# Altium project PCB_Project1.PrjPCB
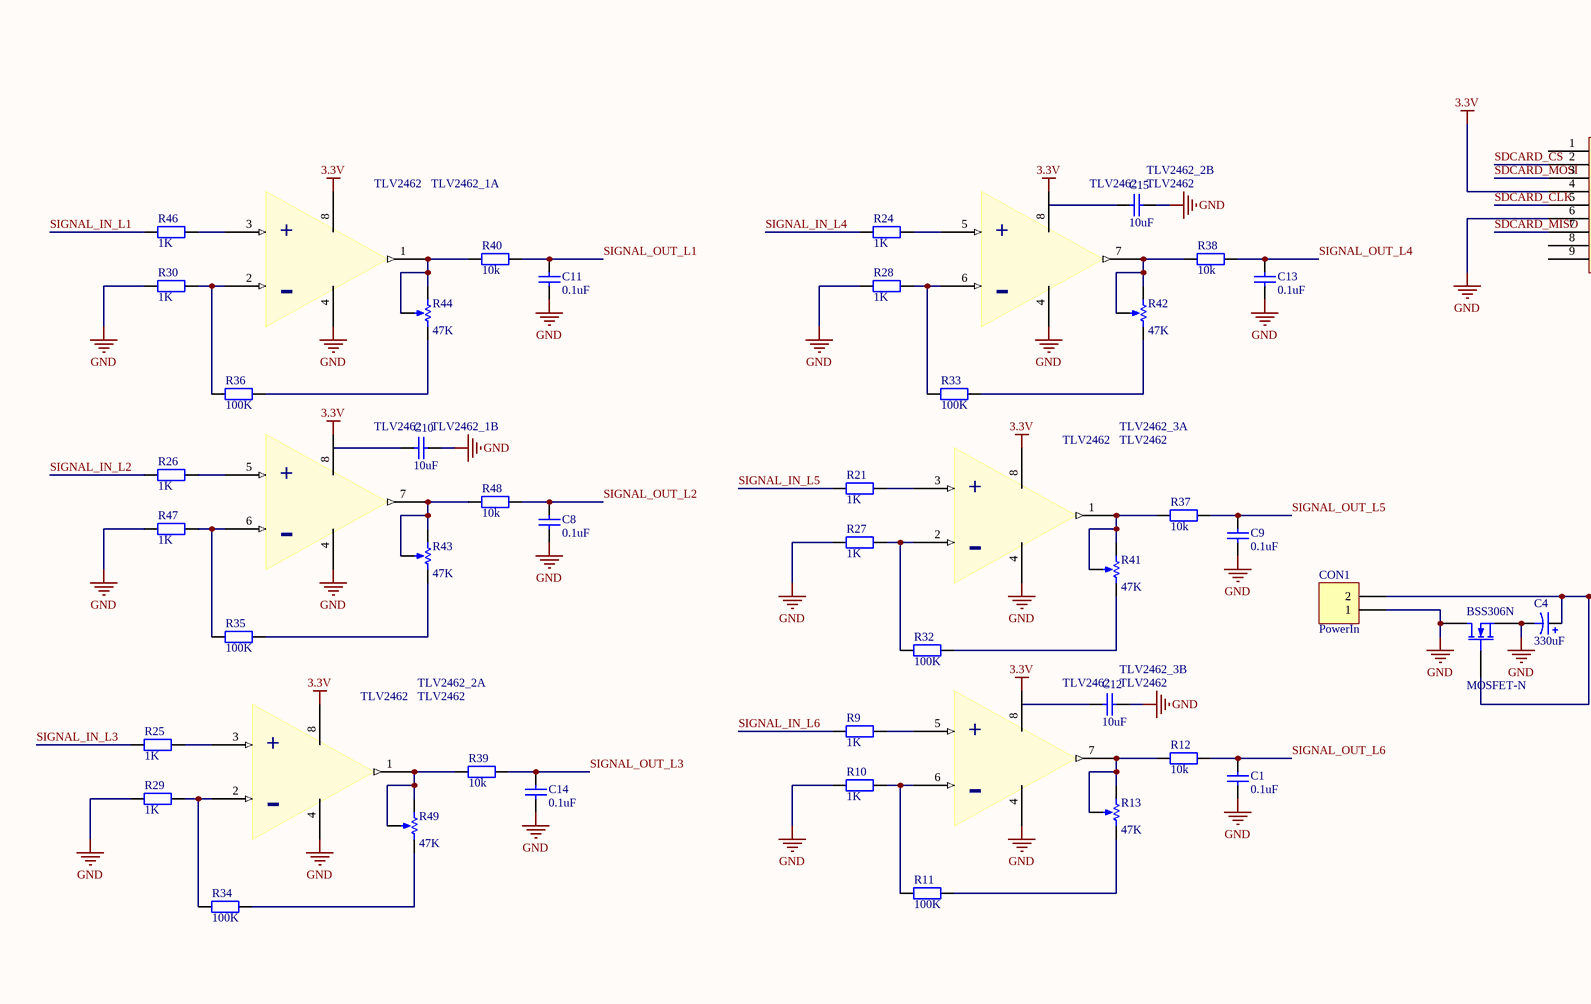
[diagram p0: control.SchDoc, top left]
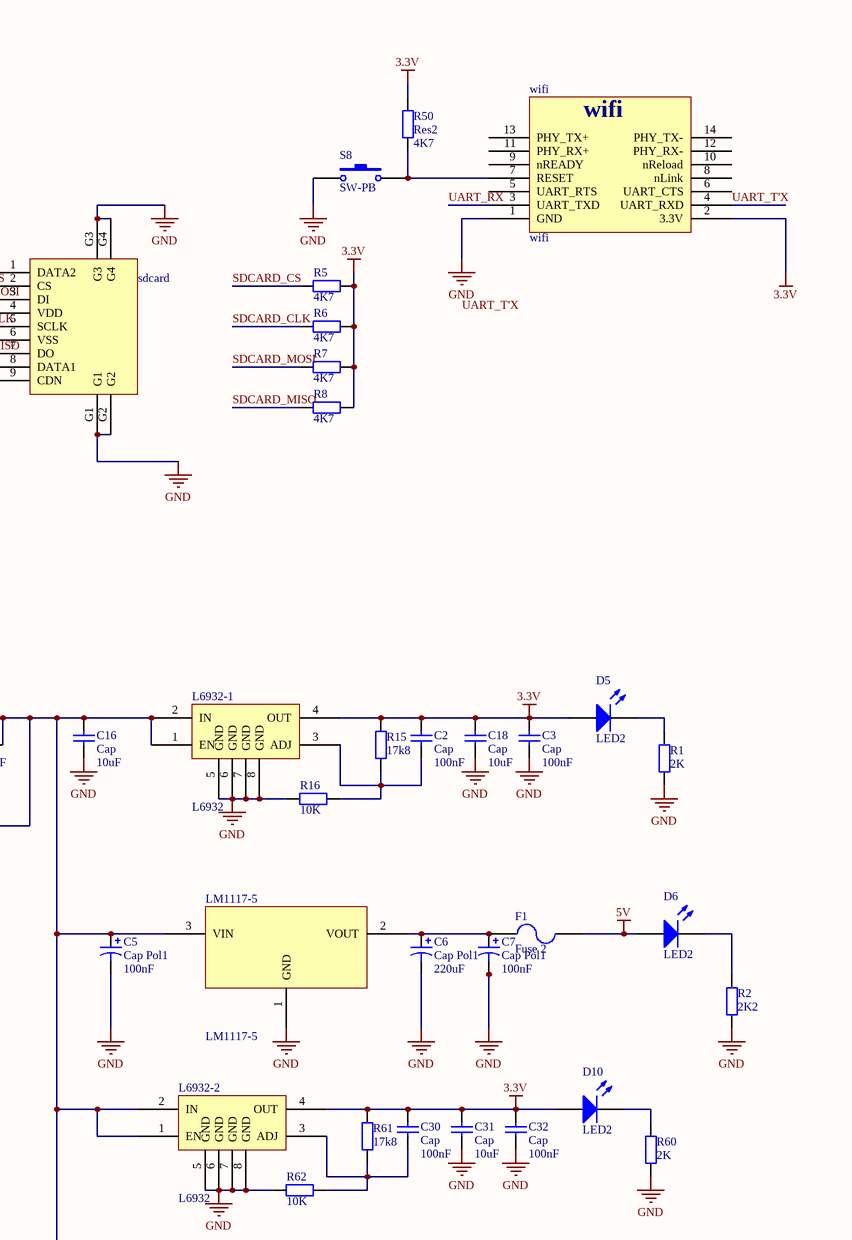
[diagram p1: control.SchDoc, top right]
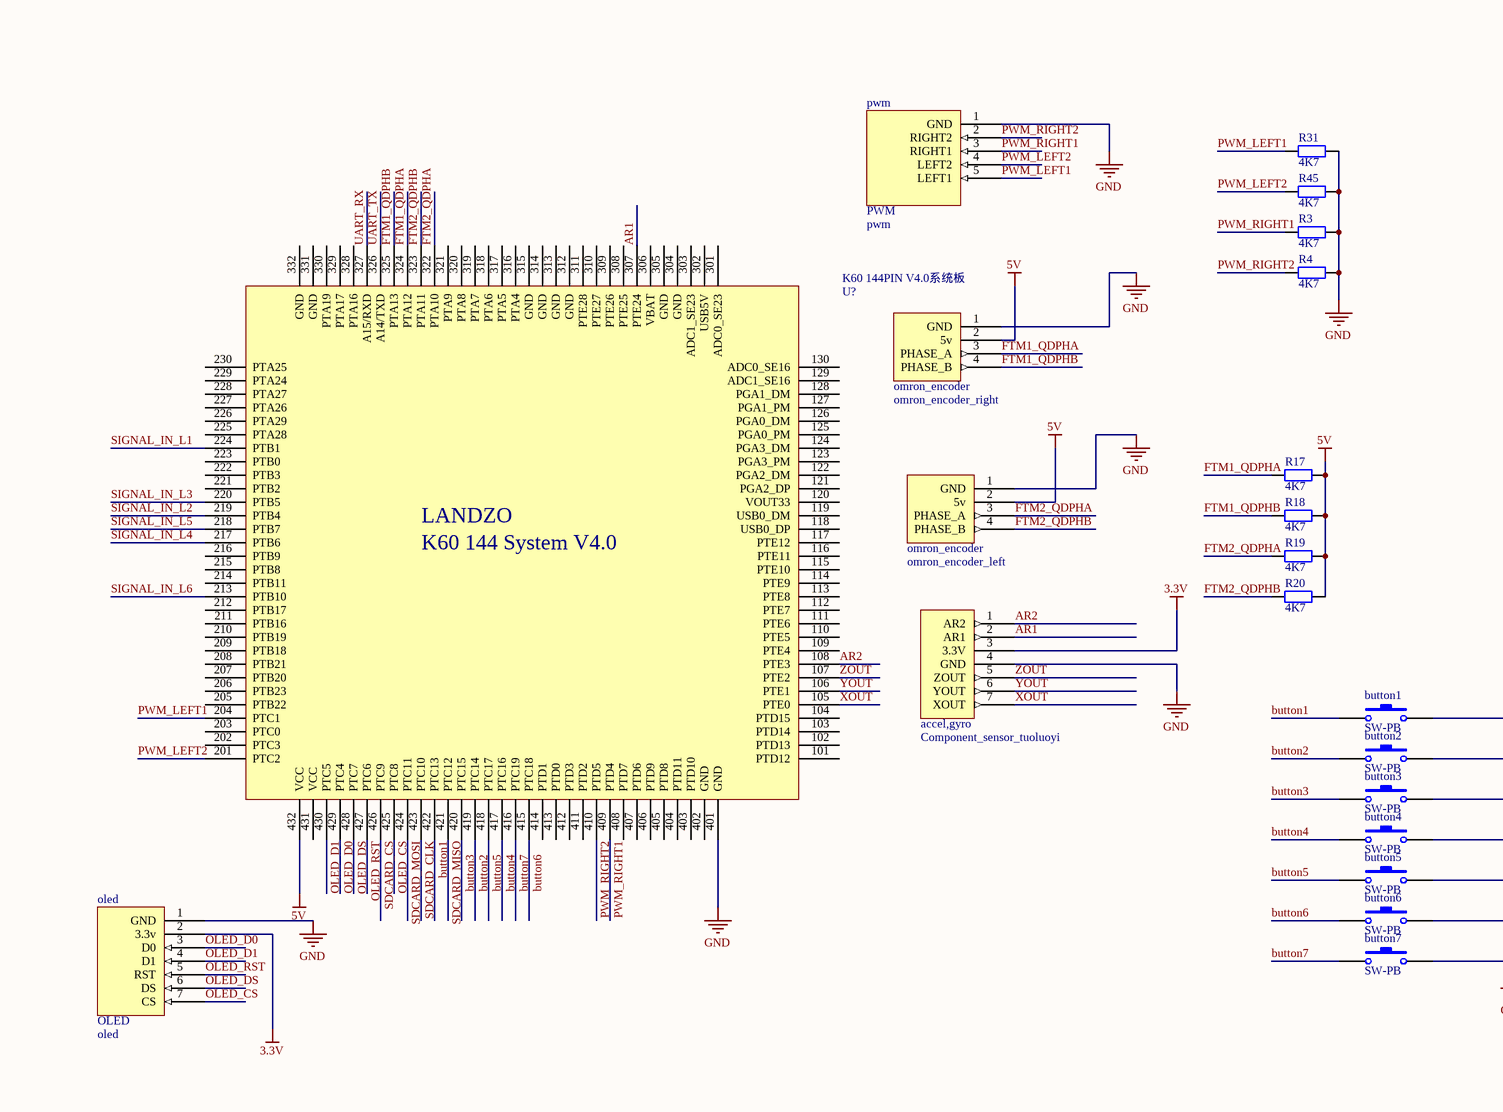
[diagram p2: control.SchDoc, bottom left]
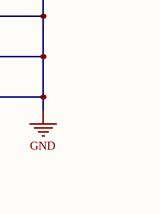
[diagram p3: control.SchDoc, bottom right]
1 sheet, 98 parts. Net scope: global (net labels, ports and power ports of the same name join across sheets).

## Sheet control.SchDoc
size 482 x 482 mm; PageSetup: Record=PageOptions|CenterHorizontal=True|CenterVertical=True|PrintScale=1.00|XCorrection=1.00|YCorrection=1.00|PrintKind=1|BorderSize=5000000|LeftOffset=0|BottomOffset=0|Orientation=2|PaperLength=1000|PaperWidth=1000|Scale=100|PaperSource=7|PrintQuality=-4|MediaType=1|DitherType=10|PaperKind=A6|PrintScaleMode=1

### Parts
BSS306N  MOSFET-N  [E3]
button1  SW-PB  [SPST-2]
button2  SW-PB  [SPST-2]
button3  SW-PB  [SPST-2]
button4  SW-PB  [SPST-2]
button5  SW-PB  [SPST-2]
button6  SW-PB  [SPST-2]
button7  SW-PB  [SPST-2]
C1  value 0.1uF  [6-0805_M]  (hidden comment: Cap)
C2  Cap  value 100nF  [6-0805_M]
C3  Cap  value 100nF  [6-0805_M]
C4  value 330uF  [RB7.6-15]  (hidden comment: Cap Pol1)
C5  Cap Pol1  value 100nF  [RAD-0.1]
C6  Cap Pol1  value 220uF  [RAD-0.1]
C7  Cap Pol1  value 100nF  [RAD-0.1]
C8  value 0.1uF  [6-0805_M]  (hidden comment: Cap)
C9  value 0.1uF  [6-0805_M]  (hidden comment: Cap)
C10  value 10uF  [6-0805_M]  (hidden comment: Cap)
C11  value 0.1uF  [6-0805_M]  (hidden comment: Cap)
C12  value 10uF  [6-0805_M]  (hidden comment: Cap)
C13  value 0.1uF  [6-0805_M]  (hidden comment: Cap)
C14  value 0.1uF  [6-0805_M]  (hidden comment: Cap)
C15  value 10uF  [6-0805_M]  (hidden comment: Cap)
C16  Cap  value 10uF  [6-0805_M]
C18  Cap  value 10uF  [6-0805_M]
C30  Cap  value 100nF  [6-0805_M]
C31  Cap  value 10uF  [6-0805_M]
C32  Cap  value 100nF  [6-0805_M]
CON1  PowerIn
D5  LED2  [6-0805_M]
D6  LED2  [6-0805_M]
D10  LED2  [6-0805_M]
F1  Fuse 2  [PIN-W2/E2.8]
K60_144PIN_V4.0系统板  U?  [K60_Board]
L6932-1  L6932  [L6932]
L6932-2  L6932  [L6932]
LM1117-5  LM1117-5  [SOT223_M]
oled  oled  [HDR1X7H]
omron_encoder_left  omron_encoder  [HDR1X4H]  (value not drawn)
omron_encoder_right  omron_encoder  [HDR1X4]  (value not drawn)
pwm  pwm  [HDR1X5H]
R1  value 2K  [6-0805_M]  (hidden comment: Res2)
R2  value 2K2  [6-0805_M]  (hidden comment: Res2)
R3  value 4K7  [6-0805_M]  (hidden comment: Res2)
R4  value 4K7  [6-0805_M]  (hidden comment: Res2)
R5  value 4K7  [6-0805_M]  (hidden comment: Res2)
R6  value 4K7  [6-0805_M]  (hidden comment: Res2)
R7  value 4K7  [6-0805_M]  (hidden comment: Res2)
R8  value 4K7  [6-0805_M]  (hidden comment: Res2)
R9  value 1K  [6-0805_M]  (hidden comment: Res2)
R10  value 1K  [6-0805_M]  (hidden comment: Res2)
R11  value 100K  [6-0805_M]  (hidden comment: Res2)
R12  value 10k  [6-0805_M]  (hidden comment: Res2)
R13  value 47K  [VR5]  (hidden comment: R4)
R15  value 17k8  [6-0805_M]  (hidden comment: Res2)
R16  value 10K  [6-0805_M]  (hidden comment: Res2)
R17  value 4K7  [6-0805_M]  (hidden comment: Res2)
R18  value 4K7  [6-0805_M]  (hidden comment: Res2)
R19  value 4K7  [6-0805_M]  (hidden comment: Res2)
R20  value 4K7  [6-0805_M]  (hidden comment: Res2)
R21  value 1K  [6-0805_M]  (hidden comment: Res2)
R24  value 1K  [6-0805_M]  (hidden comment: Res2)
R25  value 1K  [6-0805_M]  (hidden comment: Res2)
R26  value 1K  [6-0805_M]  (hidden comment: Res2)
R27  value 1K  [6-0805_M]  (hidden comment: Res2)
R28  value 1K  [6-0805_M]  (hidden comment: Res2)
R29  value 1K  [6-0805_M]  (hidden comment: Res2)
R30  value 1K  [6-0805_M]  (hidden comment: Res2)
R31  value 4K7  [6-0805_M]  (hidden comment: Res2)
R32  value 100K  [6-0805_M]  (hidden comment: Res2)
R33  value 100K  [6-0805_M]  (hidden comment: Res2)
R34  value 100K  [6-0805_M]  (hidden comment: Res2)
R35  value 100K  [6-0805_M]  (hidden comment: Res2)
R36  value 100K  [6-0805_M]  (hidden comment: Res2)
R37  value 10k  [6-0805_M]  (hidden comment: Res2)
R38  value 10k  [6-0805_M]  (hidden comment: Res2)
R39  value 10k  [6-0805_M]  (hidden comment: Res2)
R40  value 10k  [6-0805_M]  (hidden comment: Res2)
R41  value 47K  [VR5]  (hidden comment: R4)
R42  value 47K  [VR5]  (hidden comment: R4)
R43  value 47K  [VR5]  (hidden comment: R4)
R44  value 47K  [VR5]  (hidden comment: R4)
R45  value 4K7  [6-0805_M]  (hidden comment: Res2)
R46  value 1K  [6-0805_M]  (hidden comment: Res2)
R47  value 1K  [6-0805_M]  (hidden comment: Res2)
R48  value 10k  [6-0805_M]  (hidden comment: Res2)
R49  value 47K  [VR5]  (hidden comment: R4)
R50  Res2  value 4K7  [6-0805_M]
R60  value 2K  [6-0805_M]  (hidden comment: Res2)
R61  value 17k8  [6-0805_M]  (hidden comment: Res2)
R62  value 10K  [6-0805_M]  (hidden comment: Res2)
S8  SW-PB  [SPST-2]
sdcard  sdcard
sensor_tuoluoyi  Component_sensor_tuoluoyi  [HDR1X7]
TLV2462_1  TLV2462  [SOP127P600X175-8L]  (value not drawn)  (parts A,B of 2)
TLV2462_2  TLV2462  [SOP127P600X175-8L]  (parts A,B of 2)
TLV2462_3  TLV2462  [SOP127P600X175-8L]  (parts A,B of 2)
wifi  wifi

### Nets
3.3V: C2.2 C3.2 C18.2 C30.2 C31.2 C32.2 D5.1(A) D10.1(A) L6932-1.4(OUT) L6932-2.4(OUT) oled.2(3.3v) R5.2 R6.2 R7.2 R8.2 R15.2 R50.2 R61.2 sdcard.4(VDD) sensor_tuoluoyi.3(3.3V) TLV2462_1.8(VCC) TLV2462_2.8(VCC) TLV2462_3.8(VCC) wifi.2(3.3V)
5V: D6.1(A) F1.2 K60_144PIN_V4.0系统板.432(VCC) omron_encoder_left.2(5v) omron_encoder_right.2(5v) R17.2 R18.2 R19.2 R20.2
GND: BSS306N.1(D) BSS306N.3(S) button1.2 button2.2 button3.2 button4.2 button5.2 button6.2 button7.2 C1.1 C3.1 C4.2 C5.2 C6.2 C7.2 C8.1 C9.1 C10.2 C11.1 C12.2 C13.1 C14.1 C15.2 C16.1 C18.1 C31.1 C32.1 CON1.1 K60_144PIN_V4.0系统板.401(GND) L6932-1.5(GND) L6932-1.6(GND) L6932-1.7(GND) L6932-1.8(GND) L6932-2.5(GND) L6932-2.6(GND) L6932-2.7(GND) L6932-2.8(GND) LM1117-5.1(GND) oled.1(GND) omron_encoder_left.1(GND) omron_encoder_right.1(GND) pwm.1(GND) R1.1 R2.1 R3.2 R4.2 R10.1 R16.1 R27.1 R28.1 R29.1 R30.1 R31.2 R45.2 R47.1 R60.1 R62.1 S8.1 sdcard.6(VSS) sdcard.G1 sdcard.G2 sdcard.G3 sdcard.G4 sensor_tuoluoyi.4(GND) TLV2462_1.4(GND) TLV2462_2.4(GND) TLV2462_3.4(GND) wifi.1(GND)
AR1: K60_144PIN_V4.0系统板.307(PTE24) sensor_tuoluoyi.2(AR1)
AR2: K60_144PIN_V4.0系统板.108(PTE3) sensor_tuoluoyi.1(AR2)
button1: button1.1 K60_144PIN_V4.0系统板.422(PTC13)
button2: button2.1 K60_144PIN_V4.0系统板.419(PTC14)
button3: button3.1 K60_144PIN_V4.0系统板.420(PTC15)
button4: button4.1 K60_144PIN_V4.0系统板.417(PTC16)
button5: button5.1 K60_144PIN_V4.0系统板.418(PTC17)
button6: button6.1 K60_144PIN_V4.0系统板.415(PTC18)
button7: button7.1 K60_144PIN_V4.0系统板.416(PTC19)
FTM1_QDPHA: K60_144PIN_V4.0系统板.324(PTA12) omron_encoder_right.3(PHASE_A) R17.1
FTM1_QDPHB: K60_144PIN_V4.0系统板.325(PTA13) omron_encoder_right.4(PHASE_B) R18.1
FTM2_QDPHA: K60_144PIN_V4.0系统板.322(PTA10) omron_encoder_left.3(PHASE_A) R19.1
FTM2_QDPHB: K60_144PIN_V4.0系统板.323(PTA11) omron_encoder_left.4(PHASE_B) R20.1
OLED_CS: K60_144PIN_V4.0系统板.425(PTC8) oled.7(CS)
OLED_D0: K60_144PIN_V4.0系统板.429(PTC4) oled.3(D0)
OLED_D1: K60_144PIN_V4.0系统板.430(PTC5) oled.4(D1)
OLED_DS: K60_144PIN_V4.0系统板.428(PTC7) oled.6(DS)
OLED_RST: K60_144PIN_V4.0系统板.427(PTC6) oled.5(RST)
PWM_LEFT1: K60_144PIN_V4.0系统板.204(PTC1) pwm.5(LEFT1) R31.1
PWM_LEFT2: K60_144PIN_V4.0系统板.201(PTC2) pwm.4(LEFT2) R45.1
PWM_RIGHT1: K60_144PIN_V4.0系统板.409(PTD4) pwm.3(RIGHT1) R3.1
PWM_RIGHT2: K60_144PIN_V4.0系统板.410(PTD5) pwm.2(RIGHT2) R4.1
SDCARD_CLK: K60_144PIN_V4.0系统板.423(PTC10) R6.1 sdcard.5(SCLK)
SDCARD_CS: K60_144PIN_V4.0系统板.426(PTC9) R5.1 sdcard.2(CS)
SDCARD_MISO: K60_144PIN_V4.0系统板.421(PTC12) R8.1 sdcard.7(DO)
SDCARD_MOSI: K60_144PIN_V4.0系统板.424(PTC11) R7.1 sdcard.3(DI)
SIGNAL_IN_L1: K60_144PIN_V4.0系统板.224(PTB1) R46.1
SIGNAL_IN_L2: K60_144PIN_V4.0系统板.219(PTB4) R26.1
SIGNAL_IN_L3: K60_144PIN_V4.0系统板.220(PTB5) R25.1
SIGNAL_IN_L4: K60_144PIN_V4.0系统板.217(PTB6) R24.1
SIGNAL_IN_L5: K60_144PIN_V4.0系统板.218(PTB7) R21.1
SIGNAL_IN_L6: K60_144PIN_V4.0系统板.213(PTB10) R9.1
SIGNAL_OUT_L1: C11.2 R40.2
SIGNAL_OUT_L2: C8.2 R48.2
SIGNAL_OUT_L3: C14.2 R39.2
SIGNAL_OUT_L4: C13.2 R38.2
SIGNAL_OUT_L5: C9.2 R37.2
SIGNAL_OUT_L6: C1.2 R12.2
UART_RX: K60_144PIN_V4.0系统板.327(A15/RXD) wifi.3(UART_TXD)
UART_T'X: wifi.4(UART_RXD)
UART_TX: K60_144PIN_V4.0系统板.326(A14/TXD)
XOUT: K60_144PIN_V4.0系统板.105(PTE0) sensor_tuoluoyi.7(XOUT)
YOUT: K60_144PIN_V4.0系统板.106(PTE1) sensor_tuoluoyi.6(YOUT)
ZOUT: K60_144PIN_V4.0系统板.107(PTE2) sensor_tuoluoyi.5(ZOUT)
NetBSS306N_2: BSS306N.2(G) C4.1 C5.1 C16.2 CON1.2 L6932-1.1(EN) L6932-1.2(IN) L6932-2.1(EN) L6932-2.2(IN) LM1117-5.3(VIN)
NetC2_1: C2.1 L6932-1.3(ADJ) R15.1 R16.2
NetC6_1: C6.1 C7.1 F1.1 LM1117-5.2(VOUT)
NetC30_1: C30.1 L6932-2.3(ADJ) R61.1 R62.2
NetD5_2: D5.2(K) R1.2
NetD6_2: D6.2(K) R2.2
NetD10_2: D10.2(K) R60.2
NetR9_2: R9.2 TLV2462_3.5
NetR10_2: R10.2 R11.1 TLV2462_3.6
NetR11_2: R11.2 R13.2(BOT)
NetR12_1: R12.1 R13.1(TOP) R13.3(TAP) TLV2462_3.7
NetR21_2: R21.2 TLV2462_3.3
NetR24_2: R24.2 TLV2462_2.5
NetR25_2: R25.2 TLV2462_2.3
NetR26_2: R26.2 TLV2462_1.5
NetR27_2: R27.2 R32.1 TLV2462_3.2
NetR28_2: R28.2 R33.1 TLV2462_2.6
NetR29_2: R29.2 R34.1 TLV2462_2.2
NetR30_2: R30.2 R36.1 TLV2462_1.2
NetR32_2: R32.2 R41.2(BOT)
NetR33_2: R33.2 R42.2(BOT)
NetR34_2: R34.2 R49.2(BOT)
NetR35_1: R35.1 R47.2 TLV2462_1.6
NetR35_2: R35.2 R43.2(BOT)
NetR36_2: R36.2 R44.2(BOT)
NetR37_1: R37.1 R41.1(TOP) R41.3(TAP) TLV2462_3.1
NetR38_1: R38.1 R42.1(TOP) R42.3(TAP) TLV2462_2.7
NetR39_1: R39.1 R49.1(TOP) R49.3(TAP) TLV2462_2.1
NetR40_1: R40.1 R44.1(TOP) R44.3(TAP) TLV2462_1.1
NetR43_1: R43.1(TOP) R43.3(TAP) R48.1 TLV2462_1.7
NetR46_2: R46.2 TLV2462_1.3
NetR50_1: R50.1 S8.2 wifi.7(RESET)

Not connected (* = marked no-connect by the designer): C10 1; C12 1; C15 1; K60_144PIN_V4.0系统板 101(PTD12) 102(PTD13) 103(PTD14) 104(PTD15) 109(PTE4) 110(PTE5) 111(PTE6) 112(PTE7) 113(PTE8) 114(PTE9) 115(PTE10) 116(PTE11) 117(PTE12) 118(USB0_DP) 119(USB0_DM) 120(VOUT33) 121(PGA2_DP) 122(PGA2_DM) 123(PGA3_PM) 124(PGA3_DM) 125(PGA0_PM) 126(PGA0_DM) 127(PGA1_PM) 128(PGA1_DM) 129(ADC1_SE16) 130(ADC0_SE16) 202(PTC3) 203(PTC0) 205(PTB22) 206(PTB23) 207(PTB20) 208(PTB21) 209(PTB18) 210(PTB19) 211(PTB16) 212(PTB17) 214(PTB11) 215(PTB8) 216(PTB9) 221(PTB2) 222(PTB3) 223(PTB0) 225(PTA28) 226(PTA29) 227(PTA26) 228(PTA27) 229(PTA24) 230(PTA25) 301(ADC0_SE23) 302(USB5V) 303(ADC1_SE23) 304(GND) 305(GND) 306(VBAT) 308(PTE25) 309(PTE26) 310(PTE27) 311(PTE28) 312(GND) 313(GND) 314(GND) 315(GND) 316(PTA4) 317(PTA5) 318(PTA6) 319(PTA7) 320(PTA8) 321(PTA9) 328(PTA16) 329(PTA17) 330(PTA19) 331(GND) 332(GND) 402(GND) 403(PTD10) 404(PTD11) 405(PTD8) 406(PTD9) 407(PTD6) 408(PTD7) 411(PTD2) 412(PTD3) 413(PTD0) 414(PTD1) 431(VCC); sdcard 1(DATA2) 8(DATA1) 9(CDN); wifi 5(UART_RTS) 6(UART_CTS) 8(nLink) 9(nREADY) 10(nReload) 11(PHY_RX+) 12(PHY_RX-) 13(PHY_TX+) 14(PHY_TX-)

### Notes on the sheet
- Labels drawn without touching a wire or pin: UART_T'X
- (in symbol Component_sensor_tuoluoyi) accel,gyro
- (in symbol K60 144PIN V4.0系统板) LANDZO; K60 144 System V4.0
- (in symbol oled) OLED
- (in symbol pwm) PWM
- (in symbol TLV2462, part A) +; -
- (in symbol TLV2462, part B) +; -

### Library data of the parts
BSS306N = MOSFET-N: N-Channel MOSFET; Published: 8-Jun-2000; LatestRevisionDate: 17-Jul-2002; LatestRevisionNote: Re-released for DXP Platform.; PackageVersion: 1995/1996; PackageReference: E3; Publisher: Altium Limited; PackageDescription: TO, Flat Index; 3 In-Line, Axial Leads; Body Dia. 4.6mm; Lead Dia. 0.5 mm (max)
button1-button7 S8 = SW-PB: Switch; Published: 24-Mar-1999; LatestRevisionDate: 17-Jul-2002; LatestRevisionNote: Re-released for DXP Platform.; PackageReference: SPST-2; Publisher: Altium Limited; PackageDescription: Switch; 2 Leads
C1-C3 C8-C16 C18 C30-C32 = Cap: Capacitor; Published: 8-Jun-2000; LatestRevisionDate: 17-Jul-2002; LatestRevisionNote: Re-released for DXP Platform.; PackageReference: RAD-0.3; Publisher: Altium Limited; PackageDescription: Radial Cap, Thru-Hole; 2 Leads; 0.3 in Pin Spacing
C4-C7 = Cap Pol1: Polarized Capacitor (Radial); Published: 8-Jun-2000; LatestRevisionDate: 17-Jul-2002; LatestRevisionNote: Re-released for DXP Platform.; PackageReference: RB7.6-15; Publisher: Altium Limited; PackageDescription: Polarized Capacitor (Radial); 2 Leads
CON1 = Header 2: Header, 2-Pin; LatestRevisionDate: 17-Jul-2002; LatestRevisionNote: Re-released for DXP Platform.; Publisher: Altium Limited
D5 D6 D10 = LED2: Typical RED, GREEN, YELLOW, AMBER GaAs LED; Published: 8-Jun-2000; LatestRevisionDate: 17-Jul-2002; LatestRevisionNote: Re-released for DXP Platform.; PackageVersion: Feb-2002; PackageReference: 3.2X1.6X1.1; Publisher: Altium Limited; PackageDescription: SM LED; 2 Flat Leads
F1 = Fuse 2: Fuse; Published: 8-Jun-2000; LatestRevisionDate: 17-Jul-2002; LatestRevisionNote: Re-released for DXP Platform.; PackageReference: PIN-W2/E2.8; Publisher: Altium Limited; PackageDescription: Thru-Hole; 2 Leads
K60_144PIN_V4.0系统板 = K60 144PIN V4.0系统板
R1-R12 R15-R21 R24-R40 R45-R48 R50 R60-R62 = Res2: Resistor; Published: 8-Jun-2000; LatestRevisionDate: 17-Jul-2002; LatestRevisionNote: Re-released for DXP Platform.; PackageReference: AXIAL-0.4; Publisher: Altium Limited; PackageDescription: Axial Device, Thru-Hole; 2 Leads; 0.4 in Pin Spacing
R13 R41-R44 R49 = RPot: Potentiometer; Sim Note: Enter the Resistance value and the set point into parameter fields.; Set Position: 0.5; Published: 8-Jun-2000; LatestRevisionDate: 17-Jul-2002; LatestRevisionNote: Re-released for DXP Platform.; PackageReference: VR5; Publisher: Altium Limited; PackageDescription: Variable Resistor, Thru-Hole; 3 Leads